# Altium schematic sheet Ethernet DP.SchDoc
size A4; SheetNumber: 7; SheetTotal: 7
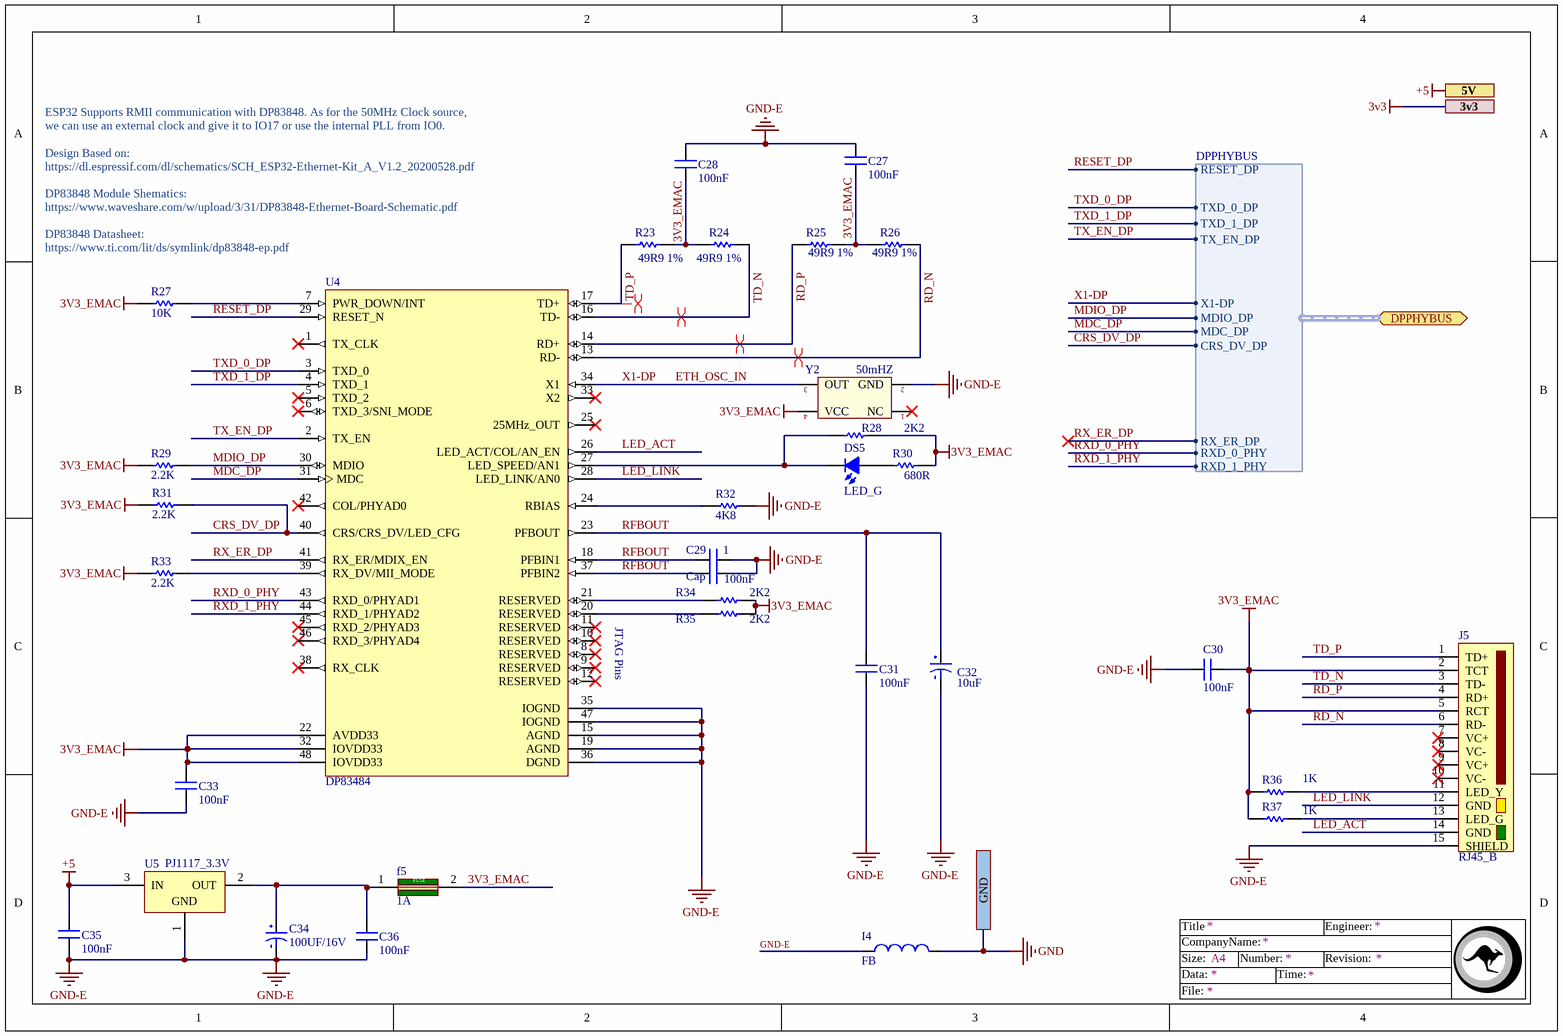
[diagram p0: Ethernet DP.SchDoc]

## Parts
1  Cap  [Cap0805]
C27  100nF  [Cap0805]
C28  100nF  [Cap0805]
C29  100nF  [Cap0805]
C30  100nF  [Cap0805]
C31  100nF  [Cap0805]
C32  10uF  [CAPMOL_B]
C33  100nF  [Cap0805]
C34  100UF/16V  [CAPMOL_A]
C35  100nF  [Cap0805]
C36  100nF  [Cap0805]
DS5  LED_G  [LED_0805Green]
f5  1A  [1206]
I4  FB  [1206]
J5  RJ45_B  [RJ45_B]
R23  49R9 1%  [R0805]
R24  49R9 1%  [R0805]
R25  49R9 1%  [R0805]
R26  49R9 1%  [R0805]
R27  10K  [R0805]
R28  2K2  [R0805]
R29  2.2K  [R0805]
R30  680R  [R0805]
R31  2.2K  [R0805]
R32  4K8  [R0805]
R33  2.2K  [R0805]
R34  2K2  [R0805]
R35  2K2  [R0805]
R36  1K  [R0805]
R37  1K  [R0805]
U4  DP83484  [DP83484]
U5  PJ1117_3.3V  [PJ1117s]
Y2  50mHZ  [Crystall 50Mhz]

## Ports
3v3 (see Dashboard - Multifunctional Probe[4B], Core-ESP32[3D], Input - Output[3D], Power Management[3C]), 5V (see Dashboard - Multifunctional Probe[4B], Core-ESP32[3D], Input - Output[3D], Power Management[3B]), DPPHYBUS (bidir, harness DPPHYBUS, see Dashboard - Multifunctional Probe[4C], Core-ESP32[4C]), GND (see Dashboard - Multifunctional Probe[4B], Core-ESP32[3D], Input - Output[3D], Power Management[3D], USB2Serial[2D])

## Harnesses
DPPHYBUS: RESET_DP, TXD_0_DP, X1-DP, TXD_1_DP, TX_EN_DP, MDIO_DP, MDC_DP, CRS_DV_DP, RX_ER_DP, RXD_0_PHY, RXD_1_PHY

## Nets
3v3: port 3v3
3V3_EMAC: C27.1 C28.1 C30.2 C33.1 f5.2(OUT) J5.2(TCT) J5.5(RCT) R23.1 R24.2 R25.1 R26.2 R27.2 R28.1 R29.2 R30.1 R31.2 R33.2 R34.1 R35.1 R36.2 R37.2 U4.22(AVDD33) U4.32(IOVDD33) U4.48(IOVDD33) Y2.4(VCC)
+5: C35.2 U5.3(IN) ; port 5V
GND: I4.2 ; port GND
GND-E: 1.2 C27.2 C28.2 C29.2 C30.1 C31.1 C32.1 C33.2 C34.1 C35.1 C36.1 I4.1 J5.15(SHIELD) R32.1 U4.15(AGND) U4.19(AGND) U4.35(IOGND) U4.36(DGND) U4.47(IOGND) U5.1(GND) Y2.2(GND)
CRS_DV_DP: R31.1 U4.40(CRS/CRS_DV/LED_CFG) ; port DPPHYBUS.CRS_DV_DP
ETH_OSC_IN: U4.34(X1) Y2.3(OUT) ; port DPPHYBUS.X1-DP  [also labelled X1-DP]
LED_ACT: J5.14(GND) U4.26(LED_ACT/COL/AN_EN)
LED_LINK: J5.12(GND) U4.28(LED_LINK/AN0)
MDC_DP: U4.31(MDC) ; port DPPHYBUS.MDC_DP
MDIO_DP: R29.1 U4.30(MDIO) ; port DPPHYBUS.MDIO_DP
RD_N: J5.6(RD-) R26.1 U4.13(RD-)
RD_P: J5.4(RD+) R25.2 U4.14(RD+)
RESET_DP: U4.29(RESET_N) ; port DPPHYBUS.RESET_DP
RFBOUT: 1.1 C29.1 C31.2 C32.2 U4.18(PFBIN1) U4.23(PFBOUT) U4.37(PFBIN2)
RX_ER_DP: U4.41(RX_ER/MDIX_EN) ; port DPPHYBUS.RX_ER_DP
RXD_0_PHY: U4.43(RXD_0/PHYAD1) ; port DPPHYBUS.RXD_0_PHY
RXD_1_PHY: U4.44(RXD_1/PHYAD2) ; port DPPHYBUS.RXD_1_PHY
TD_N: J5.3(TD-) R24.1 U4.16(TD-)
TD_P: J5.1(TD+) R23.2 U4.17(TD+)
TX_EN_DP: U4.2(TX_EN) ; port DPPHYBUS.TX_EN_DP
TXD_0_DP: U4.3(TXD_0) ; port DPPHYBUS.TXD_0_DP
TXD_1_DP: U4.4(TXD_1) ; port DPPHYBUS.TXD_1_DP
NetC34_2: C34.2 C36.2 f5.1(IN) U5.2(OUT)
NetDS5_A: DS5.A R30.2
NetDS5_K: DS5.K R28.2 U4.27(LED_SPEED/AN1)
NetJ5_11: J5.11(LED_Y) R36.1
NetJ5_13: J5.13(LED_G) R37.1
NetR27_1: R27.1 U4.7(PWR_DOWN/INT)
NetR32_2: R32.2 U4.24(RBIAS)
NetR33_1: R33.1 U4.39(RX_DV/MII_MODE)
NetR34_2: R34.2 U4.21(RESERVED)
NetR35_2: R35.2 U4.20(RESERVED)

Not connected (* = marked no-connect by the designer): J5 7(VC+)* 8(VC-)* 9(VC+)* 10(VC-)*; U4 1(TX_CLK)* 5(TXD_2)* 6(TXD_3/SNI_MODE)* 8(RESERVED)* 9(RESERVED)* 10(RESERVED)* 11(RESERVED)* 12(RESERVED)* 25(25MHz_OUT)* 33(X2)* 38(RX_CLK)* 42(COL/PHYAD0)* 45(RXD_2/PHYAD3)* 46(RXD_3/PHYAD4)*; Y2 1(NC)*

## Layout directives
differential pair: RD_N, RD_P, TD_N, TD_P

## Notes on the sheet
- ESP32 Supports RMII communication with DP83848. As for the 50MHz Clock source, we can use an external clock and give it to IO17 or use the internal PLL from IO0.
- Design Based on:
  https://dl.espressif.com/dl/schematics/SCH_ESP32-Ethernet-Kit_A_V1.2_20200528.pdf
  DP83848 Module Shematics:
  https://www.waveshare.com/w/upload/3/31/DP83848-Ethernet-Board-Schematic.pdf
  DP83848 Datasheet:
  https://www.ti.com/lit/ds/symlink/dp83848-ep.pdf
- (near U4) JTAG Pins
- Title
- Size:
- Data:
- CompanyName:
- A4
- Number:
- Time:
- Revision:
- Engineer:
- File:
- (in symbol Fuse) FUSE

## Library data of the parts
1 C27-C31 C33 C35 C36 = Cap: Surface mount Capacitor
C32 C34 = Cap_P: Polarity
DS5 = LED
f5 = Fuse
I4 = Inductor: Indicator
J5 = RJ45_B: Ethernet Connector
R23-R37 = Resistor
U4 = DP83484: Ethernet PHY
U5 = PJ1117_3.3V: Regulator
Y2 = Oscillator